# EasyEDA Pro project DCP_main.eprj, schematic Schematic2
Board Name: DeskPHUB_LV; Create Date: 2025-11-24; Page Name: P1; Project Name: DCP_main; Schematic Name: Schematic2; Update Date: 2025-11-27; Company: 嘉立创EDA; Page Size: A4; Version: V1.0
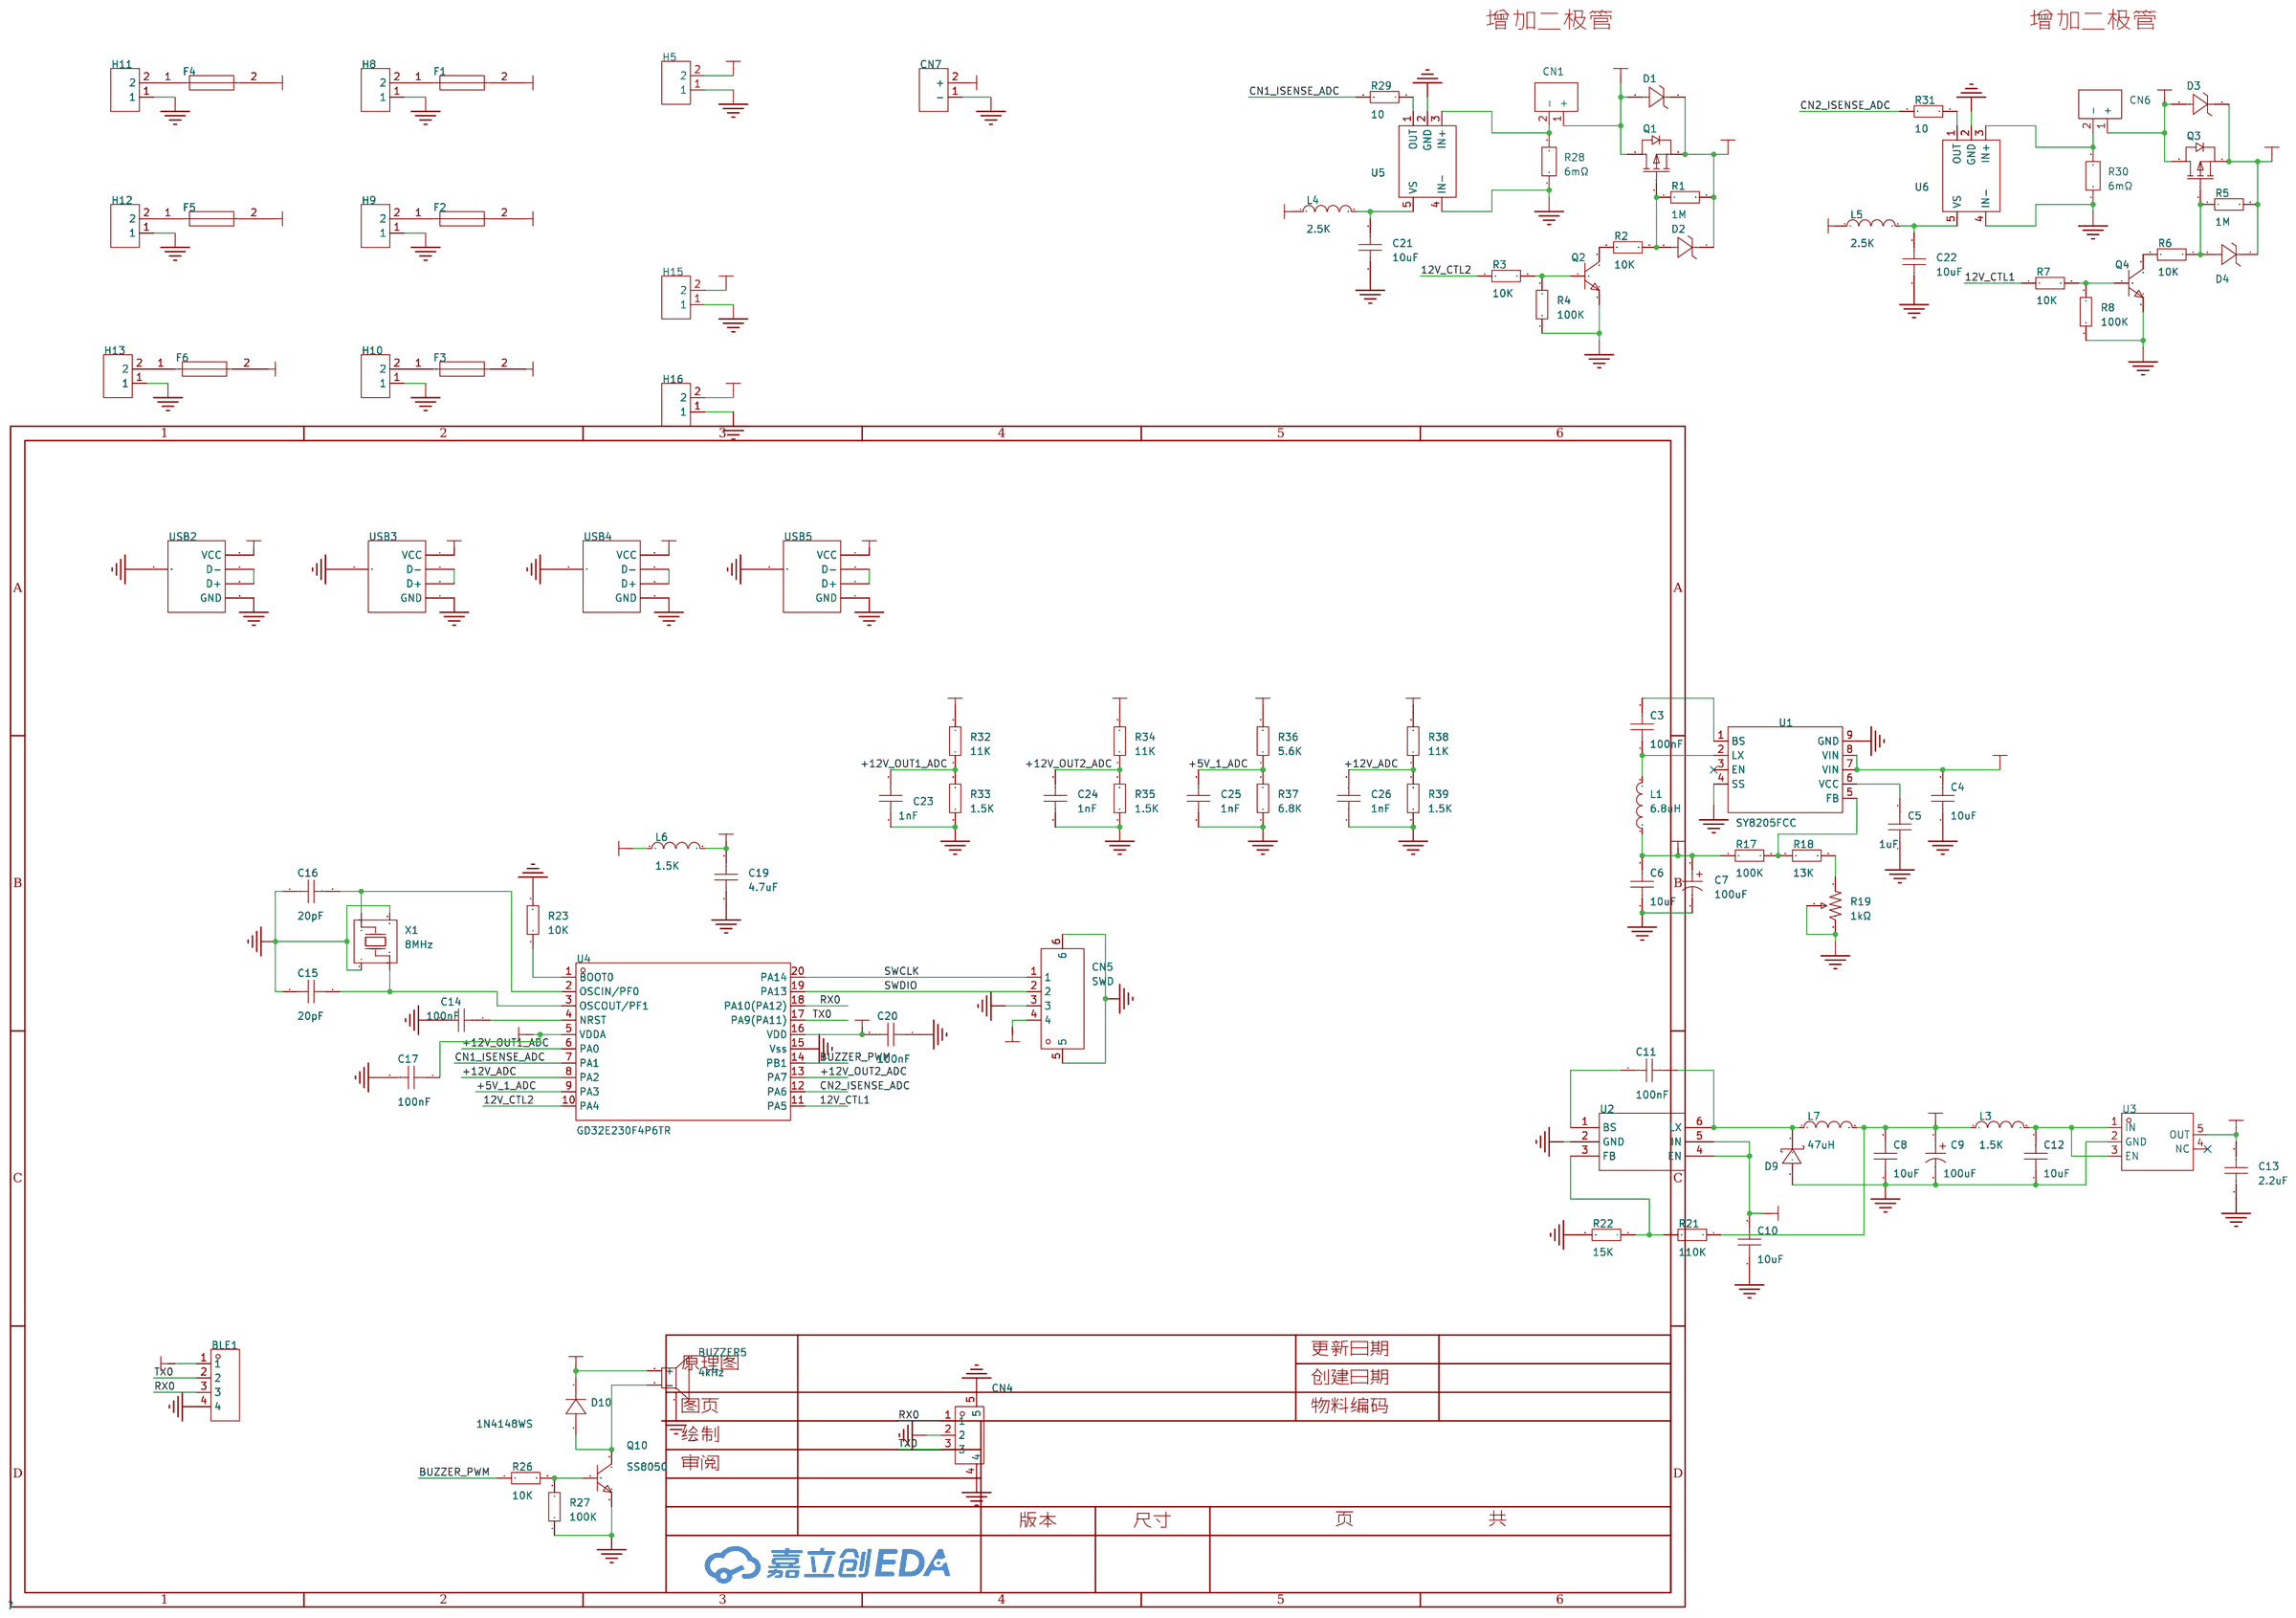
[diagram p1: schematic sheet]

## Parts
BLE1  -  [HDR-TH_4P-P2.54-V-F]
BUZZER5  4kHz  [BUZ-SMD_L5.0-W5.5-P4.60]
C3  100nF  [C0603]
C4  10uF  [C0805]
C5  1uF  [C0603]
C6  10uF  [C0805]
C7  100uF  [CAP-SMD_BD6.3-L6.6-W6.6-RD]
C8  10uF  [C0805]
C9  100uF  [CAP-SMD_BD6.3-L6.6-W6.6-RD]
C10  10uF  [C0805]
C11  100nF  [C0603]
C12  10uF  [C0805]
C13  2.2uF  [C0603]
C14  100nF  [C0603]
C15  20pF  [C0603]
C16  20pF  [C0603]
C17  100nF  [C0603]
C19  4.7uF  [C0603]
C20  100nF  [C0603]
C21  10uF  [C0603]
C22  10uF  [C0603]
C23  1nF  [C0603]
C24  1nF  [C0603]
C25  1nF  [C0603]
C26  1nF  [C0603]
CN1  XT30UPB-F30.G.Y  [CONN-TH_XT30UPB-F]
CN4  WAFER-GH1.25-3PLB  [CONN-SMD_3P-P1.25_XUNPU_WAFER-GH1.25-3PLB]
CN5  SWD  [CONN-SMD_4P-P1.27_GH125-S04DCA-00]
CN6  XT30UPB-F30.G.Y  [CONN-TH_XT30UPB-F]
CN7  XT60-M.  [CONN-TH_XT60]
D1  P4SMA18A  [SMA_L4.3-W2.7-LS5.0-RD]
D2  ZMM18  [LL-34_L3.5-W1.5-RD]
D3  P4SMA18A  [SMA_L4.3-W2.7-LS5.0-RD]
D4  ZMM18  [LL-34_L3.5-W1.5-RD]
D9  1N5819WS  [SOD-323_L1.8-W1.3-LS2.5-RD]
D10  1N4148WS  [SOD-323_L1.8-W1.3-LS2.5-RD]
F1  SMD1812-110-33  [F1812]
F2  SMD1812-110-33  [F1812]
F3  SMD1812-110-33  [F1812]
F4  SMD1812-110-33  [F1812]
F5  SMD1812-110-33  [F1812]
F6  SMD1812-110-33  [F1812]
H5  XY-XHB2.54-2A11  [CONN-TH_2P-P2.50_XY-XHB2.54-2A11]
H8  XY-XHB2.54-2A11  [CONN-TH_2P-P2.50_XY-XHB2.54-2A11]
H9  XY-XHB2.54-2A11  [CONN-TH_2P-P2.50_XY-XHB2.54-2A11]
H10  XY-XHB2.54-2A11  [CONN-TH_2P-P2.50_XY-XHB2.54-2A11]
H11  XY-XHB2.54-2A11  [CONN-TH_2P-P2.50_XY-XHB2.54-2A11]
H12  XY-XHB2.54-2A11  [CONN-TH_2P-P2.50_XY-XHB2.54-2A11]
H13  XY-XHB2.54-2A11  [CONN-TH_2P-P2.50_XY-XHB2.54-2A11]
H15  XY-XHB2.54-2A11  [CONN-TH_2P-P2.50_XY-XHB2.54-2A11]
H16  XY-XHB2.54-2A11  [CONN-TH_2P-P2.50_XY-XHB2.54-2A11]
L1  6.8uH  [IND-SMD_L11.5-W10.0_FXL1040]
L3  1.5K  [L0805]
L4  2.5K  [L0603]
L5  2.5K  [L0603]
L6  1.5K  [L0805]
L7  47uH  [IND-SMD_L4.0-W4.0_FNR40XXS]
Q1  NCE40P70K  [TO-252-2_L6.6-W6.1-P4.57-LS9.9-TL-CW]
Q2  MMS8050-H-TP  [SOT-23-3_L2.9-W1.3-P1.90-LS2.4-BR]
Q3  NCE40P70K  [TO-252-2_L6.6-W6.1-P4.57-LS9.9-TL-CW]
Q4  MMS8050-H-TP  [SOT-23-3_L2.9-W1.3-P1.90-LS2.4-BR]
Q10  SS8050  [SOT-23-3_L2.9-W1.3-P1.90-LS2.4-BR]
R1  1M  [R0603]
R2  10K  [R0603]
R3  10K  [R0603]
R4  100K  [R0603]
R5  1M  [R0603]
R6  10K  [R0603]
R7  10K  [R0603]
R8  100K  [R0603]
R17  100K  [R0603]
R18  13K  [R0603]
R19  1kΩ  [RES-ADJ-SMD_JER33X-1-14]
R21  110K  [R0603]
R22  15K  [R0603]
R23  10K  [R0603]
R26  10K  [R0603]
R27  100K  [R0603]
R28  6mΩ  [R2512]
R29  10  [R0603]
R30  6mΩ  [R2512]
R31  10  [R0603]
R32  11K  [R0603]
R33  1.5K  [R0603]
R34  11K  [R0603]
R35  1.5K  [R0603]
R36  5.6K  [R0603]
R37  6.8K  [R0603]
R38  11K  [R0603]
R39  1.5K  [R0603]
U1  SY8205FCC  [SOIC-8_L5.0-W4.0-P1.27-LS6.0-BL-EP2.0]
U2  SY8401ABC  [SOT-23-6_L2.9-W1.6-P0.95-LS2.8-BR]
U3  TPS7A2033PDBVR  [SOT-23-5_L2.9-W1.6-P0.95-LS2.8-BR]
U4  GD32E230F4P6TR  [TSSOP-20_L6.5-W4.4-P0.65-LS6.4-BL]
U5  INA180A1IDBVR  [SOT-23-5_L3.0-W1.7-P0.95-LS2.8-BR]
U6  INA180A1IDBVR  [SOT-23-5_L3.0-W1.7-P0.95-LS2.8-BR]
USB2  AF 180°ZJB13.7  [USB-A-TH_AF-ZJB13.7]
USB3  AF 180°ZJB13.7  [USB-A-TH_AF-ZJB13.7]
USB4  AF 180°ZJB13.7  [USB-A-TH_AF-ZJB13.7]
USB5  AF 180°ZJB13.7  [USB-A-TH_AF-ZJB13.7]
X1  8MHz  [OSC-SMD_4P-L3.2-W2.5-BL]

## Library data of the parts
BLE1 = HDR-F_2.54_1x4P: Supplier Part: C2718488; Supplier Footprint: 插件
BUZZER5 = MLT-5020: LCSC Part Name: 无源(外部驱动) 电磁式 4kHz; Supplier Part: C94598; Manufacturer: 华能; Supplier Footprint: SMD,5x5mm; JLCPCB Part Class: 扩展库; Datasheet: https://item.szlcsc.com/datasheet/MLT-5020/95796.html; Supplier: LCSC; Driver Circuitry: 无源(外部驱动); Technology: 电磁式; Voltage Rating: 3V; Voltage - Supply: 2V~4V; Current Consumption: 100mA; Sound Pressure Level(SPL): 75dB; Length: 5.2mm; Width: 5.2mm; Height: 2.5mm; Operating Temperature: -20℃~+70℃
C3 C5 C11 C13-C17 C19 C20 C22-C26 = CAP_0603: Supplier Footprint: 0603
C4 C6 C8 C10 C12 = CAP_0805: Supplier Footprint: 0805
C7 C9 = MA35V100M6X8: LCSC Part Name: 100uF ±20% 35V; Supplier Part: C46550467; Manufacturer: JIERR(捷而瑞); Supplier Footprint: SMD,D6.3xL7.7mm; JLCPCB Part Class: 扩展库; Datasheet: https://item.szlcsc.com/datasheet/MA35V100M6X8/48680161.html; Supplier: LCSC; Tolerance: ±20%; Voltage Rating: 35V; Ripple Current: 2.9A@100kHz; Equivalent Series Resistance(ESR): 30mΩ@100kHz; Type: 聚合物; Diameter: 6.3mm; Height - Seated (Max): 7mm; Lifetime: 2000hrs@105℃; Operating Temperature: -55℃~+105℃
C21 = CAP_0603: Supplier Footprint: 0603; Comment: 3.3v
CN1 CN6 = XT30UPB-F30.G.Y: LCSC Part Name: AMASS(艾迈斯)直立焊板式连接器XT30UPB30-F.G.*; Supplier Part: C108769; Manufacturer: AMASS(艾迈斯); JLCPCB Part Class: 扩展库; Datasheet: https://item.szlcsc.com/datasheet/XT30UPB-F30.G.Y/109989.html; Supplier: LCSC; Type: 航模插头; Colour: 黄色; RatedVoltage: DC 500V; InterfaceType: 母头; MetalMaterial: 镀金; InsulationMaterial: PA; RatedCurrent: 15A; contact resistance: 0.65mΩ
CN4 = WAFER-GH1.25-3PLB: LCSC Part Name: 1x3P 间距:1.25mm 立贴 系列:GH; Supplier Part: C3029369; Manufacturer: XUNPU(讯普); Supplier Footprint: SMD,P=1.25mm; JLCPCB Part Class: 扩展库; Datasheet: https://item.szlcsc.com/datasheet/WAFER-GH1.25-3PLB/3561381.html; Supplier: LCSC; Pins Structure: 1x3P; Pitch: 1.25mm; Mounting Type: 立贴; Reference Series: GH; Number of Pins: 3P; Number of Rows: 1; Number of PINs Per Row: 3; Current Rating: 1A; Contact Material: 黄铜; Contact Plating: 锡; Operating Temperature: -25℃~+85℃; Voltage Rating: 125V; Plastic Material: LCP; Supplementary Features: 辅助焊脚; Color: 米色; Z-Height of the Board: 4.2mm; X-Length of Bottom Edge on Board (Spacing Line): 7mm; Y-Width of Bottom Edge on Board: 4.95mm
CN5 = GH125-S04DCA-00: 参考系列:-;间距:1.25mm;插针结构:1x4P;排数:1;每排PIN数:4;行距:-;公母:公型插针;安装方式:卧贴;额定电流:1A;工作温度范围:-25℃~+85℃;; LCSC Part Name: GH1.25卧式贴片 带扣; Supplier Part: C2886767; Manufacturer: JS(钜硕电子); Supplier Footprint: SMD,P=1.25mm; JLCPCB Part Class: Extended Part; Datasheet: https://atta.szlcsc.com/upload/public/pdf/source/20210818/CD11791E5ED3EDF45A7009E9C8A2BD4C.pdf; Supplier: LCSC; Pitch: 1.25mm; Pins Structure: 1x4P; Number of Rows: 1; Number of PINs Per Row: 4; Gender: 公型插针; Mounting Style: 卧贴; Current Rating (Max): 1A; Operating Temperature Range: -25℃~+85℃
CN7 = XT60-M.: LCSC Part Name: AMASS(艾迈斯) XT60模型插头 3.5mm镀金香蕉头公头（电调端）XT60-M; Supplier Part: C98733; Manufacturer: AMASS(艾迈斯); JLCPCB Part Class: 扩展库; Datasheet: https://item.szlcsc.com/datasheet/XT60-M./99943.html; Supplier: LCSC; Type: 香蕉头; Colour: 黄色; InterfaceType: 公头; specifications: 3.5mm
D1 D3 = P4SMA18A_C41428848: LCSC Part Name: 单向TVS 15.3V截止 峰值浪涌电流：16.1A@10/1000us; Supplier Part: C41428848; Manufacturer: Slkor(萨科微); Supplier Footprint: SMA(DO-214AC); JLCPCB Part Class: 扩展库; Datasheet: https://item.szlcsc.com/datasheet/P4SMA18A/43280402.html; Supplier: LCSC; Polarity: 单向; Reverse Stand-Off Voltage (Vrwm): 15.3V; Clamping Voltage: 25.2V; Peak Pulse Current (Ipp): 16.1A@10/1000us; Peak Pulse Power Dissipation (Ppp): 400W@10/1000us; Voltage - Breakdown: 18.9V; Reverse Leakage Current (Ir): 1uA; Operating Temperature: -55℃~+150℃; Type: TVS
D2 D4 = ZMM18_C707207: Supplier Part: C707207; Manufacturer: Slkor(萨科微); Supplier Footprint: LL-34; JLCPCB Part Class: Extended Part; Datasheet: https://atta.szlcsc.com/upload/public/pdf/source/20200721/C707184_776B95022AAA01ECB528B9CFDAFDB27C.pdf; Supplier: LCSC; Diode Configuration: 独立式; Zener Voltage (Nom): 18V; Reverse Leakage Current (Ir): 100nA@13V; Zener Voltage (Range): 16.8V~19.1V; Power Dissipation: 500mW
D9 = 1N5819WS_C191023: LCSC Part Name: 电压:40V 电流:1A; Supplier Part: C191023; Manufacturer: Hottech(合科泰); Supplier Footprint: SOD-323; JLCPCB Part Class: 基础库; Datasheet: https://item.szlcsc.com/datasheet/1N5819WS/213850.html; Supplier: LCSC; Voltage - Forward(Vf@If): 600mV@1A; Voltage - DC Reverse(Vr): 40V; Current - Rectified: 1A; Non-Repetitive Peak Forward Surge Current: 25A
D10 = 1N4148WS_C917117: 二极管配置:独立式;正向压降(Vf):1.25V@150mA;直流反向耐压(Vr):100V;平均整流电流(Io):300mA;功率:400mW;反向恢复时间(trr):8ns;; LCSC Part Name: 电压:100V 电流:300mA; Supplier Part: C917117; Manufacturer: JSMSEMI(杰盛微); Supplier Footprint: SOD-323; JLCPCB Part Class: 扩展库; Datasheet: https://atta.szlcsc.com/upload/public/pdf/source/20230807/08D9F448A82EA88A23B325A669586A09.pdf; Supplier: LCSC; Diode Configuration: 独立式; Forward Voltage (Vf@If): 1.25V@150mA; Reverse Voltage (Vr): 100V; Average Rectified Current (Io): 300mA; Power Dissipation: 400mW; Reverse Leakage Current: 1uA@75V; Reverse Recovery Time (trr): 8ns; Operating Temperature: -55℃~+150℃@(Tj)
F1-F6 = SMD1812-110-33: Supplier Part: C46641155; Manufacturer: R+O(宏嘉诚); Supplier Footprint: 1812; JLCPCB Part Class: 扩展库; Datasheet: https://item.szlcsc.com/datasheet/SMD1812-110-33/48798761.html; Supplier: LCSC; Voltage - Max: 33V; Current - Max: 40A; Hold Current: 1.1A; Trip Current: 2.2A; Power Dissipation: 1W; Resistance - Initial (Ri) (Min): 45mΩ; Resistance - Post Trip (R1) (Max): 250mΩ; Time to Trip(Max): 300ms; Operating Temperature: -40℃~+85℃; Length: 4.73mm; Width: 3.41mm; Height: 1.3mm
H5 H8-H13 H15 H16 = XY-XHB2.54-2A11: LCSC Part Name: 1x2P 间距:2.5mm 直插; Supplier Part: C19271386; Manufacturer: XYECONN(辛译); Supplier Footprint: 插件,P=2.5mm; JLCPCB Part Class: 扩展库; Datasheet: https://item.szlcsc.com/datasheet/XY-XHB2.54-2A11/20540895.html; Supplier: LCSC; Pins Structure: 1x2P; Pitch: 2.5mm; Mounting Type: 直插; Number of Pins: 2P; Number of Rows: 1; Number of PINs Per Row: 2; Current Rating: 2A; Contact Material: 黄铜; Contact Plating: 锡; Operating Temperature: -25℃~+85℃; Voltage Rating: 250V; Plastic Material: PA66; Flame Retardant Rating: UL94V-0; Z-Height of the Board: 7.1mm; Y-Width of Bottom Edge on Board: 6.13mm
L1 = FXL1040-220-M: LCSC Part Name: 22uH ±20% 5.5A; Supplier Part: C475917; Manufacturer: cjiang(长江微电); Supplier Footprint: SMD,11.5x10mm; JLCPCB Part Class: 扩展库; Datasheet: https://item.szlcsc.com/datasheet/FXL1040-220-M/482450.html; Supplier: LCSC; Tolerance: ±20%; Current Rating: 5A; Current - Saturation(Isat): 5.5A; DC Resistance(DCR): 66mΩ; Type: 一体成型电感
L3 L6 = L_0805
L4 L5 = L_0603
L7 = FNR4030S100MT: LCSC Part Name: 10uH ±20% 2.4A; Supplier Part: C167879; Manufacturer: cjiang(长江微电); Supplier Footprint: SMD,4x4mm; JLCPCB Part Class: 扩展库; Datasheet: https://item.szlcsc.com/datasheet/FNR4030S100MT/179262.html; Supplier: LCSC; Tolerance: ±20%; Current Rating: 1.6A; Current - Saturation(Isat): 2.4A; DC Resistance(DCR): 130mΩ; Type: 磁胶屏蔽电感
Q1 Q3 = NCE40P70K: LCSC Part Name: 1个P沟道 耐压:40V 电流:70A; Supplier Part: C130101; Manufacturer: NCE(无锡新洁能); Supplier Footprint: TO-252-2(DPAK); JLCPCB Part Class: 扩展库; Datasheet: https://atta.szlcsc.com/upload/public/pdf/source/20170919/C130101_1505787178833976874.pdf; Supplier: LCSC; Type: 1个P沟道; Drain to Source Voltage: 40V; Current - Continuous Drain(Id): 70A; RDS(on): 10mΩ@10V,20A; Pd - Power Dissipation: 130W; Gate Threshold Voltage (Vgs(th)@Id): 1.9V; Input Capacitance(Ciss@Vds): 5.38nF@20V; Reverse Transfer Capacitance (Crss@Vds): 500pF; Operating Temperature: -55℃~+150℃
Q2 Q4 = MMS8050-H-TP: LCSC Part Name: NPN 电流:500mA 电压:25V; Supplier Part: C668971; Manufacturer: MCC(美微科); Supplier Footprint: SOT-23; JLCPCB Part Class: 扩展库; Datasheet: https://item.szlcsc.com/datasheet/MMS8050-H-TP/699030.html; Supplier: LCSC; type: NPN; Current - Collector(Ic): 500mA; Collector - Emitter Voltage VCEO: 25V; Pd - Power Dissipation: 300mW; DC Current Gain: 120@50mA,1V; Transition frequency(fT): 150MHz; Current - Collector Cutoff: 100nA; Vce Saturation(VCE(sat)): 600mV; Operating Temperature: -55℃~+150℃@(Tj); Emitter-Base Voltage(Vebo): 5V
Q10 = SS8050_C7420370: 晶体管类型:NPN;集电极电流(Ic):1.5A;集射极击穿电压(Vceo):25V;功率(Pd):300mW;直流电流增益(hFE@Ic,Vce):120@100mA,1.0V;; LCSC Part Name: 耐压:25V 电流:1.5A NPN H档 200-350; Supplier Part: C7420370; Manufacturer: 宏迦橙; Supplier Footprint: SOT-23; JLCPCB Part Class: 扩展库; Datasheet: https://atta.szlcsc.com/upload/public/pdf/source/20231222/9C4050A7669EB24B3ACD0418218817FD.pdf; Supplier: LCSC; Transistor Type: NPN; Collector Current (Ic): 1.5A; Collector-Emitter Breakdown Voltage (Vceo): 25V; Power Dissipation (Pd): 300mW; DC Current Gain (hFE@Ic,Vce): 120@100mA,1.0V; Transition Frequency (fT): 100MHz; Collector Cut-Off Current (Icbo): 100nA; Collector-Emitter Saturation Voltage (VCE(sat)@Ic,Ib): 500mV@800mA,80mA; Operating Temperature: -55℃~+150℃
R1-R8 R17 R18 R21-R23 R26 R27 R29 R31-R39 = Res_0603: Supplier Footprint: 0603
R19 = JER33X-1-53: Supplier Part: C48997891; Manufacturer: JIERR(捷而瑞); Supplier Footprint: SMD-3P,3.4x3.1mm; JLCPCB Part Class: 扩展库; Datasheet: https://item.szlcsc.com/datasheet/JER33X-1-53/51342027.html; Supplier: LCSC; Tolerance: ±25%; Power(Watts): 150mW; Temperature Coefficient: ±250ppm/℃; Number of Turns: 1
R28 R30 = JER2512F3R005: LCSC Part Name: 5mΩ 3W 2512 ±1%; Supplier Part: C46634460; Manufacturer: JIERR(捷而瑞); Supplier Footprint: 2512; JLCPCB Part Class: 扩展库; Datasheet: https://item.szlcsc.com/datasheet/JER2512F3R005/48788262.html; Supplier: LCSC; Type: 采样电阻；合金电阻; Tolerance: ±1%; Power(Watts): 3W; Temperature Coefficient: ±50ppm/℃
U1 = SY8205FCC: LCSC Part Name: 高效快速响应5A 30V输入同步降压稳压器; Supplier Part: C111875; Manufacturer: Silergy(矽力杰); Supplier Footprint: SOIC-8-EP; JLCPCB Part Class: 扩展库; Datasheet: https://item.szlcsc.com/datasheet/SY8205FCC/113104.html; Supplier: LCSC; Function: 降压型; Output Type: 可调; Voltage - Supply: 4.5V~30V; Output Current: 5A; Frequency - Switching: 500kHz; Operating Temperature: -40℃~+85℃@(TA); Synchronous Rectifier: 是; Number of Outputs: 1; Topology: 降压式; Quiescent Current: 200uA; Switch tube (built-in/external): 内置
U2 = SY8401ABC: LCSC Part Name: 高效1.2MHz 50V输入0.8A异步降压调节器; Supplier Part: C125906; Manufacturer: Silergy(矽力杰); Supplier Footprint: SOT-23-6; JLCPCB Part Class: 扩展库; Datasheet: https://item.szlcsc.com/datasheet/SY8401ABC/137186.html; Supplier: LCSC; Function: 降压型; Output Type: 可调; Voltage - Supply: 4.5V~50V; Output Current: 800mA; Frequency - Switching: 1.2MHz; Operating Temperature: -40℃~+85℃@(TA)；-40℃~+125℃@(TJ); Synchronous Rectifier: 否; Number of Outputs: 1; Topology: 降压式; Quiescent Current: 150uA; Switch tube (built-in/external): 内置
U3 = TPS7A2033PDBVR: LCSC Part Name: 具有高 PSRR 的 300mA、超低噪声、低 IQ、低压降 (LDO) 线性稳压器; Supplier Part: C2862740; Manufacturer: TI(德州仪器); Supplier Footprint: SOT-23-5; JLCPCB Part Class: 扩展库; Datasheet: https://www.ti.com/cn/lit/gpn/tps7a20; Supplier: LCSC; Output Type: 固定; Maximum Input Voltage: 6V; Output Voltage: 3.3V; Output Current: 300mA; Dropout Voltage: 140mV@(300mA); standby current: 15uA; Feature: 防静电保护；软启动；浪涌保护；低ESR；热保护(TSD)；欠压闭锁；过流保护(OCP)；带使能；防倒灌; Operating Temperature: -40℃~+125℃@(Tj); Output Polarity: 正极; Number of Outputs: 1
U4 = GD32E230F4P6TR: CPU内核:-;程序存储容量:16KB;RAM总容量:4KB;GPIO端口数量:15;工作电压范围:1.8V~3.6V;CPU最大主频:72MHz;程序存储器类型:FLASH;; Supplier Part: C2842295; Manufacturer: GigaDevice(兆易创新); Supplier Footprint: TSSOP-20; JLCPCB Part Class: 扩展库; Datasheet: https://atta.szlcsc.com/upload/public/pdf/source/20240402/A7F4CC4CD3D7DC7CD15A7FB0DE571B27.pdf; Supplier: LCSC; Program Storage Size: 16KB; RAM Size: 4KB; GPIO Ports Number: 15; Operating Voltage Range: 1.8V~3.6V; CPU Maximum Speed: 72MHz; Program Memory Type: FLASH; Operating Temperature Range: -40℃~+85℃; ADC (Bit): 12bit; PWM (Bit): 16bit; 16Bit Timer: 5; UART/USART: 1; I2C: 1; SPI: 1; Internal Comparator: 有; Peripheral/Function: 温度传感器；DMA；看门狗；LIN总线协议；PWM；IrDA；RTC实时时钟; Watchdog: 有; Real-Time Clock: 有; Infrared Data Association: 有; Direct Memory Access: 有; Internal Oscillator: 有
U5 U6 = INA180A1IDBVR: Supplier Part: C122228; Manufacturer: TI(德州仪器); Supplier Footprint: SOT-23-5; JLCPCB Part Class: 扩展库; Datasheet: https://www.ti.com/cn/lit/gpn/ina180; Supplier: LCSC; Number of Channels: 单路; Vcm - Common Mode Voltage: -200mV~26V; Gain: 20V/V; Bandwidth: 350kHz; Ib - Input Bias Current: 100nA; Vos - Input Offset Voltage: 25uV; Operating Temperature: -40℃~+125℃; Differential Voltage: -26V~26V; Single Supply: 2.7V~5.5V; Quiescent Current: 197uA; Output Current: 8mA; Input Offset Voltage Drift(Vos TC): 1uV/℃; Slew Rate: 2V/us; Common Mode Rejection Ratio (CMRR): 100dB; Noise density(eN): 40nV/√Hz@1kHz
USB2-USB5 = AF 180°ZJB13.7: LCSC Part Name: Type-A 母 直插; Supplier Part: C456015; Manufacturer: SHOU HAN(首韩); Supplier Footprint: 插件; JLCPCB Part Class: 扩展库; Datasheet: https://atta.szlcsc.com/upload/public/pdf/source/20241125/3F1287FBF237B0DC4F79F9BB9BA7EB30.pdf; Supplier: LCSC; Connector Type: Type-A; Standard: USB 2.0; Gender: 母; Mounting Style: 直插; Number of Contacts: 4P; Number of Ports: 1; Current Rating - Power (Max): 1.5A; Rated Voltage (Max): 30V; Connect-Disconnect Life: 5千次; Length: 13.7mm; Core Colour: 白色; Operating Temperature Range: -25℃~+85℃
X1 = TAXM8M4RDBCCT2T: 晶振类型:贴片晶振;频率:8MHz;常温频差:±10ppm;外接负载电容:10pF;频率稳定度(全温):±15ppm;; LCSC Part Name: 8MHz ±10ppm 10pF; Supplier Part: C400090; Manufacturer: YJX(雅晶鑫); Supplier Footprint: SMD3225-4P; JLCPCB Part Class: 扩展库; Datasheet: https://atta.szlcsc.com/upload/public/pdf/source/20190626/C400090_CF95B89E745AFE4EF2E392EF8AC009D6.pdf; Supplier: LCSC; Crystal Type: 贴片晶振; Normal temperature Frequency Tolerance: ±10ppm; External load capacitor: 10pF; Frequency Stability(Full temperature range): ±15ppm; Equivalent Series Resistance (ESR): 250Ω; Operating Temperature: -40℃~+85℃

## Nets
12V_CTL1: R7.1 U4.11(PA5)
12V_CTL2: R3.1 U4.10(PA4)
+3.3V: BLE1.1 C13.2 CN5.4 L4.1 L5.1 L6.1 U3.5(OUT)
+3.3V_MCU: C17.1 C19.1 C20.2 L6.2 U4.5(VDDA) U4.16(VDD)
+5V_1: BUZZER5.1(+) C6.2 C7.1 D10.1(C) H5.2 H15.2 H16.2 L1.1 R17.1 R36.2 USB2.1(VCC) USB3.1(VCC) USB4.1(VCC) USB5.1(VCC)
+5V_1_ADC: C25.2 R36.1 R37.2 U4.9(PA3)
+5V_2: C8.2 C9.1 L3.1 L7.2 R21.1
+12V: C4.2 C10.2 CN7.2(+) D1.1(C) D2.1(K) D3.1(C) D4.1(K) F1.2 F2.2 F3.2 F4.2 F5.2 F6.2 Q1.3(S) Q3.3(S) R1.2 R5.2 R38.2 U1.7(VIN) U1.8(VIN) U2.4(EN) U2.5(IN)
+12V_ADC: C26.2 R38.1 R39.2 U4.8(PA2)
+12V_OUT1: CN1.1(+) D1.2(A) Q1.2(D) R32.2
+12V_OUT1_ADC: C23.2 R32.1 R33.2 U4.6(PA0)
+12V_OUT2: CN6.1(+) D3.2(A) Q3.2(D) R34.2
+12V_OUT2_ADC: C24.2 R34.1 R35.2 U4.13(PA7)
GND: BLE1.4 BUZZER5.3(NC) C4.1 C5.1 C6.1 C7.2 C8.1 C9.2 C10.1 C12.1 C13.1 C14.1 C15.1 C16.1 C17.2 C19.2 C20.1 C21.1 C22.1 C23.1 C24.1 C25.1 C26.1 CN4.2 CN4.4 CN4.5 CN5.3 CN5.5 CN5.6 CN7.1(-) D9.2(A) H5.1 H8.1 H9.1 H10.1 H11.1 H12.1 H13.1 H15.1 H16.1 Q2.2(E) Q4.2(E) Q10.2(E) R4.1 R8.1 R19.2 R19.3 R22.2 R23.2 R27.1 R28.1 R30.1 R33.1 R35.1 R37.1 R39.1 U1.4(SS) U1.9(GND) U2.2(GND) U3.2(GND) U4.15(Vss) U5.2(GND) U5.4(IN-) U6.2(GND) U6.4(IN-) USB2.4(GND) USB2.5(SHLD) USB3.4(GND) USB3.5(SHLD) USB4.4(GND) USB4.5(SHLD) USB5.4(GND) USB5.5(SHLD) X1.2 X1.4
BUZZER_PWM: R26.1 U4.14(PB1)
CN1_ISENSE_ADC: R29.2 U4.7(PA1)
CN2_ISENSE_ADC: R31.2 U4.12(PA6)
RX0: BLE1.3 CN4.1 U4.18(PA10(PA12))
SWCLK: CN5.1 U4.20(PA14)
SWDIO: CN5.2 U4.19(PA13)
TX0: BLE1.2 CN4.3 U4.17(PA9(PA11))
$1N445: USB2.2(D-) USB2.3(D+)
$1N449: USB3.2(D-) USB3.3(D+)
$1N454: USB4.2(D-) USB4.3(D+)
$1N653: USB5.2(D-) USB5.3(D+)
$1N1761: D2.2(A) Q1.1(G) R1.1 R2.1
$1N2098: Q2.1(B) R3.2 R4.2
$1N2111: Q2.3(C) R2.2
$1N2457: Q4.1(B) R7.2 R8.2
$1N2465: D4.2(A) Q3.1(G) R5.1 R6.1
$1N2467: Q4.3(C) R6.2
$1N6697: C3.1 L1.2 U1.2(LX)
$1N6701: C3.2 U1.1(BS)
$1N6872: C5.2 U1.6(VCC)
$1N7190: R17.2 R18.1 U1.5(FB)
$1N7369: R18.2 R19.1
$1N7838: F1.1 H8.2
$1N7954: F2.1 H9.2
$1N8071: F3.1 H10.2
$1N8188: F4.1 H11.2
$1N8305: F5.1 H12.2
$1N8422: F6.1 H13.2
$1N9096: C11.2 D9.1(K) L7.1 U2.6(LX)
$1N9345: R21.2 R22.1 U2.3(FB)
$1N9475: C11.1 U2.1(BS)
$1N9720: C12.2 L3.2 U3.1(IN) U3.3(EN)
$1N10926: C14.2 U4.4(NRST)
$1N10928: C15.2 U4.3(OSCOUT/PF1) X1.1
$1N10929: C16.2 U4.2(OSCIN/PF0) X1.3
$1N10931: R23.1 U4.1(BOOT0)
$1N10985: Q10.1(B) R26.2 R27.2
$1N10986: BUZZER5.2(-) D10.2(A) Q10.3(C)
$1N11713: CN1.2(-) R28.2 U5.3(IN+)
$1N11917: C21.2 L4.2 U5.5(VS)
$1N11957: R29.1 U5.1(OUT)
$1N12229: C22.2 L5.2 U6.5(VS)
$1N12235: R31.1 U6.1(OUT)
$1N12268: CN6.2(-) R30.2 U6.3(IN+)

Not connected (* = marked no-connect by the designer): U1 3(EN)*; U3 4(NC)*

## Notes on the sheet
- 增加二极管
- 增加二极管
